# Altium project VCB25.PrjPCB (part 2 of 2)

## Sheet 9-Other_Inputs.SchDoc
size A4
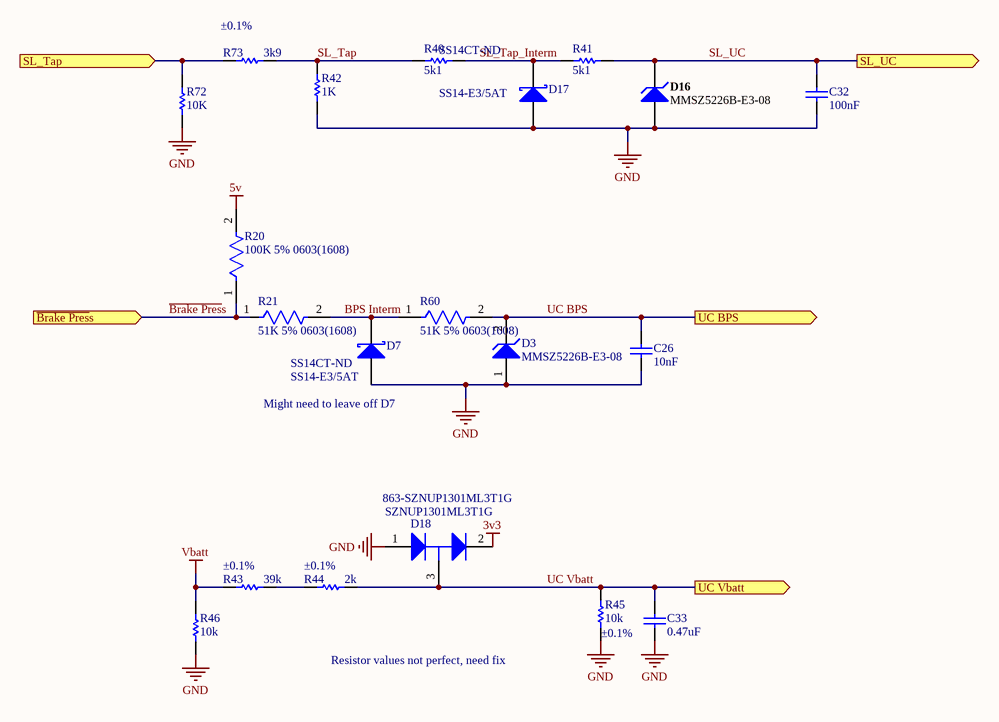
[diagram p4: 9-Other_Inputs.SchDoc]

### Parts
C26  value 10nF  [1608[0603]]  (hidden comment: Cap)
C32  value 100nF  [1608[0603]]  (hidden comment: Cap)
C33  value 0.47uF  [1608[0603]]  (hidden comment: Cap)
D3  MMSZ5226B-E3-08  [VISH-SOD-123-2_V]
D7  SS14-E3/5AT  Supplier Part Number 1: SS14CT-ND  [VISH-DO-214AC-2_V]
D16  MMSZ5226B-E3-08  [VISH-SOD-123-2_V]
D17  SS14-E3/5AT  Supplier Part Number 1: SS14CT-ND  [VISH-DO-214AC-2_V]
D18  SZNUP1301ML3T1G  Supplier Part Number 1: 863-SZNUP1301ML3T1G  [ONSC-SOT-23-3-318-08_V]
R20  100K 5% 0603(1608)  [RESC0603(1608)_N]
R21  51K 5% 0603(1608)  [RESC0603(1608)_N]
R40  value 5k1  [1608[0603]]  (hidden comment: Res1)
R41  value 5k1  [1608[0603]]  (hidden comment: Res1)
R42  value 1K  [1608[0603]]  (hidden comment: Res1)
R43  value 39k  Tolerance: ±0.1%  [1608[0603]]  (hidden comment: Res1)
R44  value 2k  Tolerance: ±0.1%  [1608[0603]]  (hidden comment: Res1)
R45  value 10k  Tolerance: ±0.1%  [1608[0603]]  (hidden comment: Res1)
R46  value 10k  [1608[0603]]  (hidden comment: Res1)
R60  51K 5% 0603(1608)  [RESC0603(1608)_N]
R72  10K  [RESC0603(1608)_N]
R73  value 3k9  Tolerance: ±0.1%  [1608[0603]]  (hidden comment: Res1)

### Ports
SL_Tap (in), SL_UC (out), UC BPS (out), UC Vbatt (out), ~{Brake Pres}s (in)

### Nets
3v3: D18.2(K)
5v: R20.2
GND: C26.1 C32.1 C33.1 D3.1(K) D7.1(A) D16.1(A) D17.1(A) D18.1(A) R42.1 R45.1 R46.1 R72.1
Vbatt: R43.1 R46.2
~{Brake Pres}s: R20.1 R21.1 ; port ~{Brake Pres}s
BPS Interm: D7.2(K) R21.2 R60.1
SL_Tap: R40.2 R42.2 R73.2
SL_Tap_Interm: D17.2(K) R40.1 R41.2
SL_UC: C32.2 D16.2(K) R41.1 ; port SL_UC
UC BPS: C26.2 D3.2(A) R60.2 ; port UC BPS
UC Vbatt: C33.2 D18.3(K/A) R44.2 R45.2 ; port UC Vbatt
NetR43_2: R43.2 R44.1
NetR72_2: R72.2 R73.1 ; port SL_Tap

### Notes on the sheet
- (near D7) Might need to leave off D7
- Resistor values not perfect, need fix

### Library data of the parts
C26 = Cap: Capacitor; Manufacturer: Yageo; Manufacturer Part Number: CC0603KRX7R9BB104; Capacitance: 0.10µF; Tolerance: ±10%; Voltage - Rated: 50V; Temperature Coefficient: X7R; Supplier 1: Digi-Key; Supplier Part Number 1: 311-1344-1-ND; RoHS: RoHS Compliant; Category: Capacitors; Stock 1: 4016262; Pricing 1: 1=0.15, 10=0.043, 25=0.0312, 50=0.0232, 100=0.0189, 250=0.0158, 500=0.01346, 1000=0.01059 (CAD); Packaging: Cut Tape (CT); Part Status: Active; Operating Temperature: -55°C ~ 125°C; Features: -; Ratings: -; Applications: General Purpose; Failure Rate: -; Mounting Type: Surface Mount, MLCC; Package / Case: 0603 (1608 Metric); Size / Dimension: 0.063" L x 0.031" W (1.60mm x 0.80mm); Height - Seated (Max): -; Thickness (Max): 0.035" (0.90mm); Lead Spacing: -; Lead Style: -; ComponentLink1URL: http://www.yageo.com/documents/recent/UPY-GPHC_X7R_6.3V-to-50V_16.pdf; ComponentLink1Description: http://www.yageo.com/documents/recent/UPY-GPHC_X7R_6.3V-to-50V_16.pdf
C32 = Cap: Capacitor; Manufacturer: Yageo; Manufacturer Part Number: CC0603KRX7R9BB102; Capacitance: 1000pF; Tolerance: ±10%; Voltage - Rated: 50V; Temperature Coefficient: X7R; Supplier 1: Digi-Key; Supplier Part Number 1: 311-1080-1-ND; RoHS: RoHS Compliant; Category: Capacitors; Stock 1: 783486; Pricing 1: 1=0.15, 10=0.029, 25=0.0212, 50=0.0158, 100=0.0129, 250=0.01084, 500=0.00928, 1000=0.00729 (CAD); Packaging: Cut Tape (CT); Part Status: Active; Operating Temperature: -55°C ~ 125°C; Features: -; Ratings: -; Applications: General Purpose; Failure Rate: -; Mounting Type: Surface Mount, MLCC; Package / Case: 0603 (1608 Metric); Size / Dimension: 0.063" L x 0.031" W (1.60mm x 0.80mm); Height - Seated (Max): -; Thickness (Max): 0.035" (0.90mm); Lead Spacing: -; Lead Style: -; ComponentLink1URL: http://www.yageo.com/documents/recent/UPY-GPHC_X7R_6.3V-to-50V_16.pdf; ComponentLink1Description: http://www.yageo.com/documents/recent/UPY-GPHC_X7R_6.3V-to-50V_16.pdf
C33 = Cap: Capacitor; Manufacturer: Yageo; Manufacturer Part Number: CC0603KRX7R8BB474; Capacitance: 0.47µF; Tolerance: ±10%; Voltage - Rated: 25V; Temperature Coefficient: X7R; Supplier 1: Digi-Key; Supplier Part Number 1: 311-1805-1-ND; RoHS: RoHS Compliant; Category: Capacitors; Stock 1: 11076; Pricing 1: 1=0.22, 10=0.158, 25=0.1156, 50=0.0898, 100=0.0745, 250=0.06168, 500=0.05226, 1000=0.04324 (CAD); Packaging: Cut Tape (CT); Part Status: Active; Operating Temperature: -55°C ~ 125°C; Features: -; Ratings: -; Applications: General Purpose; Failure Rate: -; Mounting Type: Surface Mount, MLCC; Package / Case: 0603 (1608 Metric); Size / Dimension: 0.063" L x 0.031" W (1.60mm x 0.80mm); Height - Seated (Max): -; Thickness (Max): 0.035" (0.90mm); Lead Spacing: -; Lead Style: -; ComponentLink1URL: http://www.yageo.com/documents/recent/UPY-GPHC_X7R_6.3V-to-50V_16.pdf; ComponentLink1Description: http://www.yageo.com/documents/recent/UPY-GPHC_X7R_6.3V-to-50V_16.pdf
D3 = CMP-1060-00513-1: Zener Voltage Regulator, 500 mW, 2-Pin SOD-123, Pb-Free, Tape and Reel; PartNumber: MMSZ3V6T1G; Manufacturer: On Semiconductor; P Max (W): 0.5; Packing: Tape and Reel; ComponentLink2URL: http://www.onsemi.com/pub_link/Collateral/MMSZ2V4T1-D.PDF; ComponentLink1Description: Manufacturer URL; PackageVersion: Rev. G, 10/2009; PackageDescription: 2-Pin SOD, Body 1.6 x 2.69 mm; ComponentLink2Description: Datasheet; DatasheetVersion: Rev. 11; ComponentLink3Description: Package Specification; ComponentLink3URL: http://www.onsemi.com/pub_link/Collateral/425-04.PDF; Mounting Technology: Surface Mount; PackageReference: SOD-123-2-425-04; ComponentLink1URL: http://www.onsemi.com/; RoHS: Pb-Free
D7 D17 = CMP-0549-00004-1: Schottky Barrier Rectifier, 40 V Maximum DC Blocking Voltage, -65 to 125 degC, 2-Pin SMA Case, RoHS; Manufacturer: Vishay Semiconductor; IFSM: 40 A; IF(AV): 1 A Max.; VRRM: 40 V Max.; VRMS: 28 V Max.; PackageReference: DO-214AC-2; RoHS: TRUE; DatasheetVersion: 12/17/2012; ComponentLink1Description: Manufacturer URL; ComponentLink2URL: http://www.vishay.com/docs/88746/ss12.pdf; PartNumber: SS14-E3/5AT; PackageVersion: Dec-12; Operating Temperature: -65 to 125 degC; ComponentLink3URL: http://www.vishay.com/docs/88746/ss12.pdf; PackageDescription: 2-Pin SMD, Body 4.245 x 2.665 mm, Height 2.29 mm; ComponentLink1URL: http://www.vishay.com/; ComponentLink3Description: Package Specification; ComponentLink2Description: Datasheet; Mounting Technology: Surface Mount; VDC: 40 V Max.; Supplier 1: Digi-Key
D16 = CMP-0931-00026-1: Small Signal Zener Diode, 3.3 V +/- 5%, -55 to 155 degC, 2-Pin SOD-123, RoHS, Tape and Reel; Manufacturer: Vishay Semiconductor; Manufacturer Part Number: MMSZ5226B-7-F; Tolerance: +/- 5%; Test Current (IZT1) (mA): 20; Power Dissipation (mW): 500; Int. Construction: Single; Zener Impedance (IZT1) (Max.) (Ohm): 28; Zener Voltage (NOM.) (V): 3.3; Voltage - Zener (Nom) (Vz): 3.3V; Power - Max: 500mW; Impedance (Max) (Zzt): 28 Ohm; Current - Reverse Leakage @ Vr: 25µA @ 1V; Voltage - Forward (Vf) (Max) @ If: 900mV @ 10mA; DatasheetVersion: Rev. 1.9; ComponentLink2Description: Datasheet; PackageReference: SOD-123-2; ComponentLink1URL: http://www.vishay.com/; ComponentLink1Description: Manufacturer URL; Mounting Technology: Surface Mount; ComponentLink3Description: Package Specification; ComponentLink3URL: http://www.vishay.com/docs/85774/mmsz5225.pdf; PartNumber: MMSZ5226B-E3-08; PackageDescription: 2-Pin SMD, Body 2.7 x 1.55 mm, Height 1.35 mm; Operating Temperature: -55 to 150 degC; Packing: Tape and Reel; PackageVersion: Rev. 1.9; ComponentLink2URL: http://www.vishay.com/docs/85774/mmsz5225.pdf; RoHS: TRUE; Supplier 1: Digi-Key; Supplier Part Number 1: MMSZ5226B-FDICT-ND; Category: Discrete Semiconductor Products; Stock 1: 45935; Pricing 1: 1=0.29, 10=0.263, 100=0.1426, 500=0.08778, 1000=0.05985 (CAD); Packaging: Cut Tape (CT); Part Status: Active; Mounting Type: Surface Mount; Package / Case: SOD-123; Supplier Device Package: SOD-123; ComponentLink4URL: http://www.diodes.com/_files/datasheets/ds18010.pdf; ComponentLink4Description: http://www.diodes.com/_files/datasheets/ds18010.pdf
D18 = CMP-1063-00171-1: Low Capacitance Diode Array for ESD Protection in a Single Data Line, 3-Pin SOT-23, Pb-Free, Tape and Reel; Manufacturer: On Semiconductor; C Max (pF): 0.9; Direction: Bidirectional; V(BR) Min (V): 70; Number of Lines: 1; Mounting Technology: Surface Mount; PackageReference: SOT-23-3-318-08; DatasheetVersion: Rev. 6; PackageVersion: Rev. AP, 11/2009; RoHS: Pb-Free; ComponentLink1Description: Manufacturer URL; ComponentLink1URL: http://www.onsemi.com/; PackageDescription: 3-Pin Small Outline Transistor, Body 2.92 x 1.3 mm, Pitch 0.95 mm; PartNumber: SZNUP1301ML3T1G; Packing: Tape and Reel; ComponentLink3URL: http://www.onsemi.cn/pub_link/Collateral/318-08.PDF; ComponentLink3Description: Package Specification; VRWM Max (V): 70; ComponentLink2Description: Datasheet; ComponentLink2URL: http://www.onsemi.cn/pub_link/Collateral/NUP1301ML3T1-D.PDF; Supplier 1: Mouser
R20 R21 R60 = CMP-26527-002098-1: 10kΩ ±5% 0.1W 0603 Thick Film Chip Resistor AEC-Q200 compliant; Power Rating: 100mW; Temperature Coefficient: 100ppm/°C; Resistance: 10kR; Radiation Hardening: No; Military Standard: Not; Mount: Surface Mount; Resistor Type: Thick Film; Size Code: 0603; Case/Package: 0603; Min Operating Temperature: -55°C; Construction: Rectangular; Series: RMCF; Width: 0.031inch; Length: 1.55mm; Case Code (Metric): 1608; Depth: 0.8mm; Height: 0.022inch; Packaging: Tape and Reel; Lead Free: Lead Free; Tolerance: 5%; Case Code (Imperial): 0603; Max Operating Temperature: 155°C; Contact Plating: Tin; Max Power Dissipation: 100mW; Features: Automotive AEC-Q200; Number of Terminations: 2
R40 R41 = Res1: Resistor; Manufacturer: Panasonic Electronic Components; Manufacturer Part Number: ERJ-PA3F1001V; Resistance (Ohms): 1k; Tolerance: ±1%; Power (Watts): 0.25W, 1/4W; Temperature Coefficient: ±100ppm/°C; Supplier 1: Digi-Key; Supplier Part Number 1: P1.0KBYCT-ND; RoHS: RoHS Compliant; Category: Resistors; Stock 1: 56110; Pricing 1: 1=0.22, 10=0.198, 25=0.138, 50=0.1072, 100=0.0765, 250=0.05972, 500=0.04746, 1000=0.03368 (CAD); Packaging: Cut Tape (CT); Part Status: Active; Composition: Thick Film; Features: Automotive AEC-Q200, Pulse Withstanding; Operating Temperature: -55°C ~ 155°C; Package / Case: 0603 (1608 Metric); Supplier Device Package: 0603; Size / Dimension: 0.063" L x 0.031" W (1.60mm x 0.80mm); Height - Seated (Max): 0.022" (0.55mm); Number of Terminations: 2; Failure Rate: -; ComponentLink1URL: https://industrial.panasonic.com/cdbs/www-data/pdf/RDA0000/AOA0000C243.pdf; ComponentLink1Description: https://industrial.panasonic.com/cdbs/www-data/pdf/RDA0000/AOA0000C243.pdf
R42 = Res1: Resistor; Manufacturer: Panasonic Electronic Components; Manufacturer Part Number: ERJ-PA3F1001V; Tolerance: ±1%; Power (Watts): 0.25W, 1/4W; Temperature Coefficient: ±100ppm/°C; Supplier 1: Digi-Key; Supplier Part Number 1: P1.0KBYCT-ND; RoHS: RoHS Compliant; Category: Resistors; Stock 1: 56110; Pricing 1: 1=0.22, 10=0.198, 25=0.138, 50=0.1072, 100=0.0765, 250=0.05972, 500=0.04746, 1000=0.03368 (CAD); Packaging: Cut Tape (CT); Part Status: Active; Resistance (Ohms): 1k; Composition: Thick Film; Features: Automotive AEC-Q200, Pulse Withstanding; Operating Temperature: -55°C ~ 155°C; Package / Case: 0603 (1608 Metric); Supplier Device Package: 0603; Size / Dimension: 0.063" L x 0.031" W (1.60mm x 0.80mm); Height - Seated (Max): 0.022" (0.55mm); Number of Terminations: 2; Failure Rate: -; ComponentLink1URL: https://industrial.panasonic.com/cdbs/www-data/pdf/RDA0000/AOA0000C243.pdf; ComponentLink1Description: https://industrial.panasonic.com/cdbs/www-data/pdf/RDA0000/AOA0000C243.pdf
R43 = Res1: Resistor; Manufacturer: Yageo; Manufacturer Part Number: RT0603BRD0739KL; Power (Watts): 0.1W, 1/10W; Temperature Coefficient: ±25ppm/°C; Supplier 1: Digi-Key; Supplier Part Number 1: YAG1649CT-ND; RoHS: RoHS Compliant; Category: Resistors; Stock 1: 2740; Pricing 1: 1=0.55, 10=0.464, 25=0.3376, 50=0.2446, 100=0.1814, 250=0.1392, 500=0.10966, 1000=0.07592 (CAD); Packaging: Cut Tape (CT); Part Status: Active; Resistance (Ohms): 39k; Composition: Thin Film; Features: Moisture Resistant; Operating Temperature: -55°C ~ 155°C; Package / Case: 0603 (1608 Metric); Supplier Device Package: 0603; Size / Dimension: 0.063" L x 0.031" W (1.60mm x 0.80mm); Height - Seated (Max): 0.022" (0.55mm); Number of Terminations: 2; Failure Rate: -; ComponentLink1URL: http://www.yageo.com/documents/recent/PYu-RT_1-to-0.05_RoHS_L_6.pdf; ComponentLink1Description: http://www.yageo.com/documents/recent/PYu-RT_1-to-0.05_RoHS_L_6.pdf
R44 = Res1: Resistor; Manufacturer: Yageo; Manufacturer Part Number: AT0603BRD072KL; Power (Watts): 0.1W, 1/10W; Temperature Coefficient: ±25ppm/°C; Supplier 1: Digi-Key; Supplier Part Number 1: YAG2112CT-ND; RoHS: RoHS Compliant; Category: Resistors; Stock 1: 1218; Pricing 1: 1=0.59, 10=0.431, 25=0.3188, 50=0.235, 100=0.1725, 250=0.14248, 500=0.11746, 1000=0.08498 (CAD); Packaging: Cut Tape (CT); Part Status: Active; Resistance (Ohms): 2k; Composition: Thin Film; Features: Anti-Sulfur, Automotive AEC-Q200, Moisture Resistant; Operating Temperature: -55°C ~ 155°C; Package / Case: 0603 (1608 Metric); Supplier Device Package: 0603; Size / Dimension: 0.063" L x 0.032" W (1.60mm x 0.80mm); Height - Seated (Max): 0.022" (0.55mm); Number of Terminations: 2; Failure Rate: -; ComponentLink1URL: http://www.yageo.com/documents/recent/PYu-AT_51_RoHS_L-3.pdf; ComponentLink1Description: http://www.yageo.com/documents/recent/PYu-AT_51_RoHS_L-3.pdf
R45 = Res1: Resistor; Manufacturer: Yageo; Manufacturer Part Number: RT0603BRD0710KL; Power (Watts): 0.1W, 1/10W; Temperature Coefficient: ±25ppm/°C; Supplier 1: Digi-Key; Supplier Part Number 1: YAG1236CT-ND; RoHS: RoHS Compliant; Category: Resistors; Stock 1: 2958; Pricing 1: 1=0.5, 10=0.42, 25=0.3048, 50=0.2212, 100=0.164, 250=0.12592, 500=0.0992, 1000=0.06867 (CAD); Packaging: Cut Tape (CT); Part Status: Active; Resistance (Ohms): 10k; Composition: Thin Film; Features: Moisture Resistant; Operating Temperature: -55°C ~ 155°C; Package / Case: 0603 (1608 Metric); Supplier Device Package: 0603; Size / Dimension: 0.063" L x 0.031" W (1.60mm x 0.80mm); Height - Seated (Max): 0.022" (0.55mm); Number of Terminations: 2; Failure Rate: -; ComponentLink1URL: http://www.yageo.com/documents/recent/PYu-RT_1-to-0.05_RoHS_L_6.pdf; ComponentLink1Description: http://www.yageo.com/documents/recent/PYu-RT_1-to-0.05_RoHS_L_6.pdf
R46 = Res1: Resistor; Manufacturer: Yageo; Manufacturer Part Number: RC0603JR-0710KL; Tolerance: ±5%; Power (Watts): 0.1W, 1/10W; Temperature Coefficient: ±100ppm/°C; Supplier 1: Digi-Key; Supplier Part Number 1: 311-10KGRCT-ND; RoHS: RoHS Compliant; Category: Resistors; Stock 1: 2936292; Pricing 1: 1=0.16, 10=0.016, 25=0.0112, 50=0.0084, 100=0.0062, 250=0.0048, 500=0.00382, 1000=0.00281 (CAD); Packaging: Cut Tape (CT); Part Status: Active; Resistance (Ohms): 10k; Composition: Thick Film; Features: Moisture Resistant; Operating Temperature: -55°C ~ 155°C; Package / Case: 0603 (1608 Metric); Supplier Device Package: 0603; Size / Dimension: 0.063" L x 0.031" W (1.60mm x 0.80mm); Height - Seated (Max): 0.022" (0.55mm); Number of Terminations: 2; Failure Rate: -; ComponentLink1URL: http://www.yageo.com/NewPortal/yageodocoutput?fileName=/pdf/R-Chip/PYu-RC_Group_51_RoHS_L_4.pdf; ComponentLink1Description: http://www.yageo.com/NewPortal/yageodocoutput?fileName=/pdf/R-Chip/PYu-RC_Group_51_RoHS_L_4.pdf
R72 = CMP-1012-00098-1: 10K 0.1W 5% 0603 (1608 Metric)  SMD; Case-EIA: 0603; Value: 10000.00 Ohm; Case-Metric: 1608; Technology: SMT; Tolerance: 5 %; Power: 0.1 W
R73 = Res1: Resistor; Manufacturer: Yageo; Manufacturer Part Number: RT0603BRD073K9L; Resistance (Ohms): 3.9k; Power (Watts): 0.1W, 1/10W; Temperature Coefficient: ±25ppm/°C; Supplier 1: Digi-Key; Supplier Part Number 1: YAG1656CT-ND; RoHS: RoHS Compliant; Category: Resistors; Stock 1: 10688; Pricing 1: 1=0.55, 10=0.464, 25=0.3376, 50=0.2446, 100=0.1814, 250=0.1392, 500=0.10966, 1000=0.07592 (CAD); Packaging: Cut Tape (CT); Part Status: Active; Composition: Thin Film; Features: Moisture Resistant; Operating Temperature: -55°C ~ 155°C; Package / Case: 0603 (1608 Metric); Supplier Device Package: 0603; Size / Dimension: 0.063" L x 0.031" W (1.60mm x 0.80mm); Height - Seated (Max): 0.022" (0.55mm); Number of Terminations: 2; Failure Rate: -; ComponentLink1URL: http://www.yageo.com/documents/recent/PYu-RT_1-to-0.05_RoHS_L_6.pdf; ComponentLink1Description: http://www.yageo.com/documents/recent/PYu-RT_1-to-0.05_RoHS_L_6.pdf

## Sheet 10-DashLEDs.SchDoc
size A4
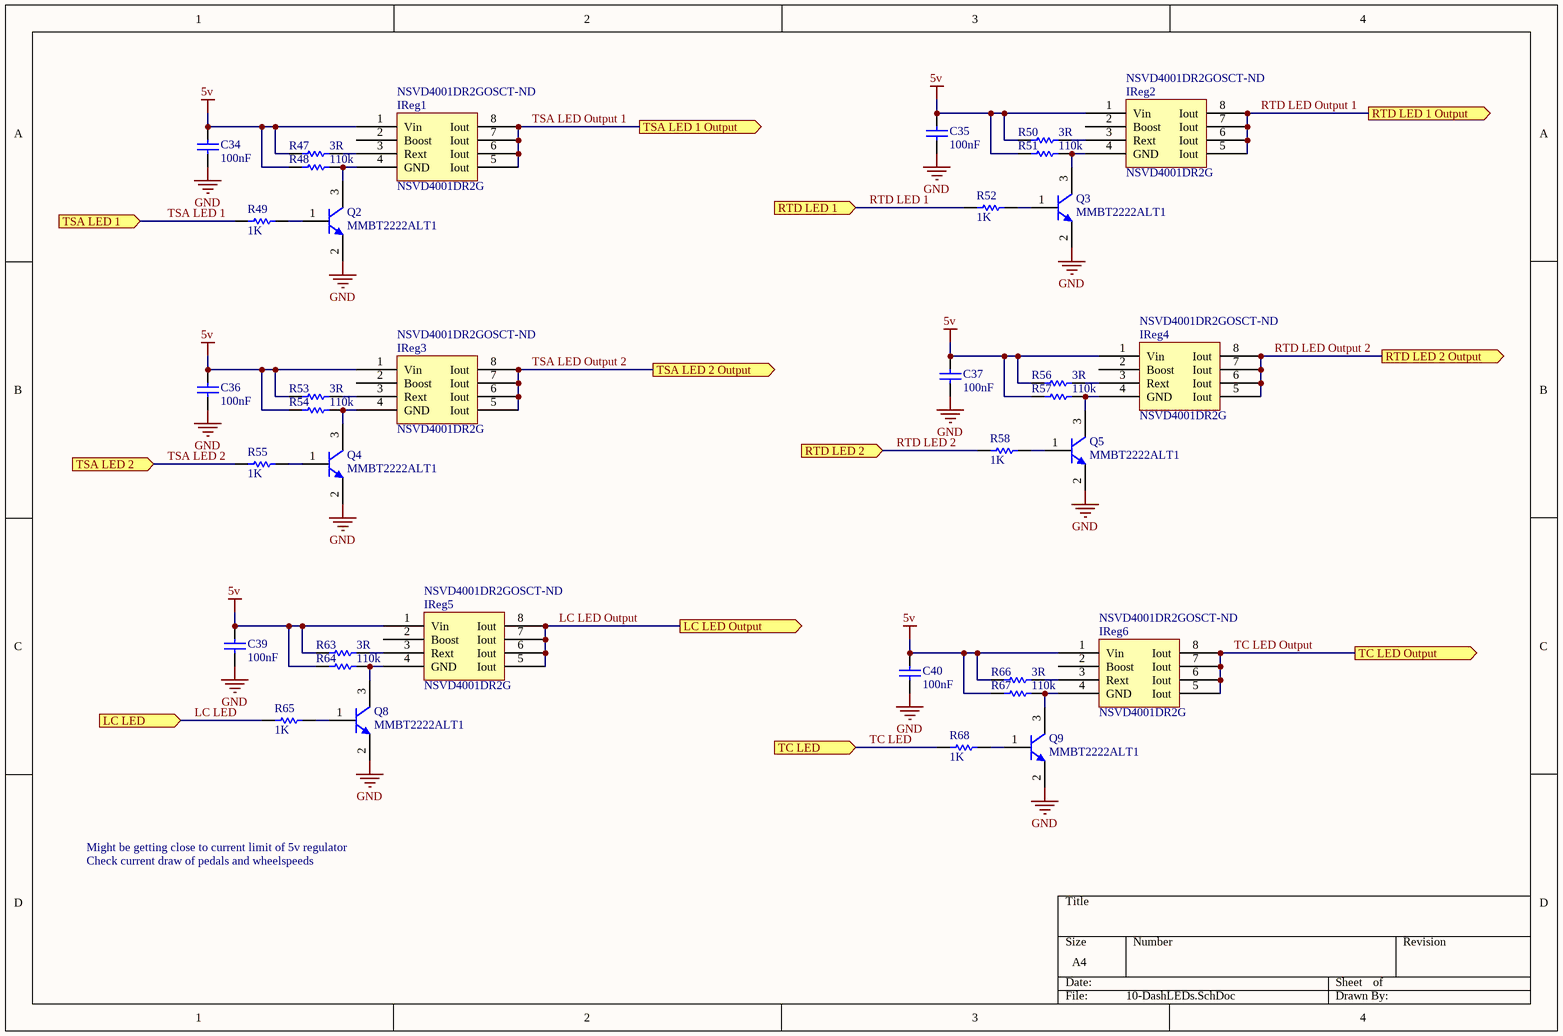
[diagram p5: 10-DashLEDs.SchDoc]

### Parts
C34  value 100nF  [1608[0603]]  (hidden comment: Cap)
C35  value 100nF  [1608[0603]]  (hidden comment: Cap)
C36  value 100nF  [1608[0603]]  (hidden comment: Cap)
C37  value 100nF  [1608[0603]]  (hidden comment: Cap)
C39  value 100nF  [1608[0603]]  (hidden comment: Cap)
C40  value 100nF  [1608[0603]]  (hidden comment: Cap)
IReg1  NSVD4001DR2G  Supplier Part Number 1: NSVD4001DR2GOSCT-ND  [SO8_M]
IReg2  NSVD4001DR2G  Supplier Part Number 1: NSVD4001DR2GOSCT-ND  [SO8_M]
IReg3  NSVD4001DR2G  Supplier Part Number 1: NSVD4001DR2GOSCT-ND  [SO8_M]
IReg4  NSVD4001DR2G  Supplier Part Number 1: NSVD4001DR2GOSCT-ND  [SO8_M]
IReg5  NSVD4001DR2G  Supplier Part Number 1: NSVD4001DR2GOSCT-ND  [SO8_M]
IReg6  NSVD4001DR2G  Supplier Part Number 1: NSVD4001DR2GOSCT-ND  [SO8_M]
Q2  MMBT2222ALT1  [ONSC-SOT-23-3-318-08_V]
Q3  MMBT2222ALT1  [ONSC-SOT-23-3-318-08_V]
Q4  MMBT2222ALT1  [ONSC-SOT-23-3-318-08_V]
Q5  MMBT2222ALT1  [ONSC-SOT-23-3-318-08_V]
Q8  MMBT2222ALT1  [ONSC-SOT-23-3-318-08_V]
Q9  MMBT2222ALT1  [ONSC-SOT-23-3-318-08_V]
R47  value 3R  [1608[0603]]  (hidden comment: Res1)
R48  value 110k  [1608[0603]]  (hidden comment: Res1)
R49  value 1K  [1608[0603]]  (hidden comment: Res1)
R50  value 3R  [1608[0603]]  (hidden comment: Res1)
R51  value 110k  [1608[0603]]  (hidden comment: Res1)
R52  value 1K  [1608[0603]]  (hidden comment: Res1)
R53  value 3R  [1608[0603]]  (hidden comment: Res1)
R54  value 110k  [1608[0603]]  (hidden comment: Res1)
R55  value 1K  [1608[0603]]  (hidden comment: Res1)
R56  value 3R  [1608[0603]]  (hidden comment: Res1)
R57  value 110k  [1608[0603]]  (hidden comment: Res1)
R58  value 1K  [1608[0603]]  (hidden comment: Res1)
R63  value 3R  [1608[0603]]  (hidden comment: Res1)
R64  value 110k  [1608[0603]]  (hidden comment: Res1)
R65  value 1K  [1608[0603]]  (hidden comment: Res1)
R66  value 3R  [1608[0603]]  (hidden comment: Res1)
R67  value 110k  [1608[0603]]  (hidden comment: Res1)
R68  value 1K  [1608[0603]]  (hidden comment: Res1)

### Ports
LC LED (in), LC LED Output (out), RTD LED 1 (in), RTD LED 1 Output (out), RTD LED 2 (in), RTD LED 2 Output (out), TC LED (in), TC LED Output (out), TSA LED 1 (in), TSA LED 1 Output (out), TSA LED 2 (in), TSA LED 2 Output (out)

### Nets
5v: C34.2 C35.2 C36.2 C37.2 C39.2 C40.2 IReg1.1(Vin) IReg2.1(Vin) IReg3.1(Vin) IReg4.1(Vin) IReg5.1(Vin) IReg6.1(Vin) R47.1 R48.1 R50.1 R51.1 R53.1 R54.1 R56.1 R57.1 R63.1 R64.1 R66.1 R67.1
GND: C34.1 C35.1 C36.1 C37.1 C39.1 C40.1 Q2.2(E) Q3.2(E) Q4.2(E) Q5.2(E) Q8.2(E) Q9.2(E)
LC LED: R65.2 ; port LC LED
LC LED Output: IReg5.5(Iout) IReg5.6(Iout) IReg5.7(Iout) IReg5.8(Iout) ; port LC LED Output
RTD LED 1: R52.2 ; port RTD LED 1
RTD LED 2: R58.2 ; port RTD LED 2
RTD LED Output 1: IReg2.5(Iout) IReg2.6(Iout) IReg2.7(Iout) IReg2.8(Iout) ; port RTD LED 1 Output  [project net RTD LED 1 Output]
RTD LED Output 2: IReg4.5(Iout) IReg4.6(Iout) IReg4.7(Iout) IReg4.8(Iout) ; port RTD LED 2 Output  [project net RTD LED 2 Output]
TC LED: R68.2 ; port TC LED
TC LED Output: IReg6.5(Iout) IReg6.6(Iout) IReg6.7(Iout) IReg6.8(Iout) ; port TC LED Output
TSA LED 1: R49.2 ; port TSA LED 1
TSA LED 2: R55.2 ; port TSA LED 2
TSA LED Output 1: IReg1.5(Iout) IReg1.6(Iout) IReg1.7(Iout) IReg1.8(Iout) ; port TSA LED 1 Output  [project net TSA LED 1 Output]
TSA LED Output 2: IReg3.5(Iout) IReg3.6(Iout) IReg3.7(Iout) IReg3.8(Iout) ; port TSA LED 2 Output  [project net TSA LED 2 Output]
NetIReg1_3: IReg1.3(Rext) R47.2
NetIReg1_4: IReg1.4(GND) Q2.3(C) R48.2
NetIReg2_3: IReg2.3(Rext) R50.2
NetIReg2_4: IReg2.4(GND) Q3.3(C) R51.2
NetIReg3_3: IReg3.3(Rext) R53.2
NetIReg3_4: IReg3.4(GND) Q4.3(C) R54.2
NetIReg4_3: IReg4.3(Rext) R56.2
NetIReg4_4: IReg4.4(GND) Q5.3(C) R57.2
NetIReg5_3: IReg5.3(Rext) R63.2
NetIReg5_4: IReg5.4(GND) Q8.3(C) R64.2
NetIReg6_3: IReg6.3(Rext) R66.2
NetIReg6_4: IReg6.4(GND) Q9.3(C) R67.2
NetQ2_1: Q2.1(B) R49.1
NetQ3_1: Q3.1(B) R52.1
NetQ4_1: Q4.1(B) R55.1
NetQ5_1: Q5.1(B) R58.1
NetQ8_1: Q8.1(B) R65.1
NetQ9_1: Q9.1(B) R68.1

Not connected (* = marked no-connect by the designer): IReg1 2(Boost); IReg2 2(Boost); IReg3 2(Boost); IReg4 2(Boost); IReg5 2(Boost); IReg6 2(Boost)

### Notes on the sheet
- Might be getting close to current limit of 5v regulator
- Check current draw of pedals and wheelspeeds

### Library data of the parts
C34-C37 C39 C40 = Cap: as C26 on sheet 9-Other_Inputs; Supplier 1: Digi-Key; Supplier Part Number 1: 311-1344-1-ND; RoHS: RoHS Compliant; Category: Capacitors; Stock 1: 4016262; Pricing 1: 1=0.15, 10=0.043, 25=0.0312, 50=0.0232, 100=0.0189, 250=0.0158, 500=0.01346, 1000=0.01059 (CAD); Packaging: Cut Tape (CT); Part Status: Active; Operating Temperature: -55°C ~ 125°C; Features: -; Ratings: -; Applications: General Purpose; Failure Rate: -; Mounting Type: Surface Mount, MLCC; Package / Case: 0603 (1608 Metric); Size / Dimension: 0.063" L x 0.031" W (1.60mm x 0.80mm); Height - Seated (Max): -; Thickness (Max): 0.035" (0.90mm); Lead Spacing: -; Lead Style: -; ComponentLink1URL: http://www.yageo.com/documents/recent/UPY-GPHC_X7R_6.3V-to-50V_16.pdf; ComponentLink1Description: http://www.yageo.com/documents/recent/UPY-GPHC_X7R_6.3V-to-50V_16.pdf
IReg1-IReg6 = LED Currnet Driver, 500mA, 30V max: Manufacturer: ON Semiconductor; Manufacturer Part Number: NUD4001DR2G; Internal Switch(s): Yes; Number of Outputs: 1; Voltage - Supply (Min): 3.6V; Voltage - Supply (Max): 30V; Voltage - Output: 28V; Current - Output / Channel: 500mA; Dimming: PWM; RoHS: RoHS Compliant; Category: Integrated Circuits (ICs); Stock 1: 212669; Pricing 1: 1=1.36, 10=1.197, 100=0.9174, 500=0.72524, 1000=0.58019 (CAD); Packaging: Cut Tape (CT); Part Status: Active; Type: Linear; Topology: -; Frequency: -; Applications: Automotive, Lighting; Operating Temperature: -40°C ~ 125°C (TA); Mounting Type: Surface Mount; Package / Case: 8-SOIC (0.154", 3.90mm Width); Supplier Device Package: 8-SOIC; ComponentLink1URL: http://www.onsemi.com/pub_link/Collateral/NUD4001-D.PDF; ComponentLink1Description: http://www.onsemi.com/pub_link/Collateral/NUD4001-D.PDF; Supplier 1: Digi-Key
Q2-Q5 Q8 Q9 = CMP-1048-00593-1: General Purpose Transistor, NPN Silicon, 3-Pin SOT-23, Tape and Reel; Manufacturer: On Semiconductor; fT Min (MHz): 300; IC Continuous (A): 0.6; ComponentLink1Description: Manufacturer URL; PackageDescription: 3-Pin Small Outline Transistor, Body 2.92 x 1.3 mm, Pitch 0.95 mm; PackageReference: SOT-23-3-318-08; Polarity: NPN; Packing: Tape and Reel; RoHS: FALSE; Mounting Technology: Surface Mount; PackageVersion: Rev. AP, 11/2009; DatasheetVersion: Rev. 10; PartNumber: MMBT2222ALT1; ComponentLink3Description: Package Specification; ComponentLink2Description: Datasheet; ComponentLink3URL: http://www.onsemi.cn/pub_link/Collateral/318-08.PDF; ComponentLink1URL: http://www.onsemi.com/; ComponentLink2URL: http://www.onsemi.cn/pub_link/Collateral/MMBT2222LT1-D.PDF
R47 R50 R53 R56 R63 R66 = Res1: Resistor; Manufacturer: Yageo; Manufacturer Part Number: RC0603FR-072RL; Resistance (Ohms): 2; Tolerance: ±1%; Power (Watts): 0.1W, 1/10W; Temperature Coefficient: ±200ppm/°C; Supplier 1: Digi-Key; Supplier Part Number 1: 311-2.00HRCT-ND; RoHS: RoHS Compliant; Category: Resistors; Stock 1: 84378; Pricing 1: 1=0.16, 10=0.03, 25=0.022, 50=0.0166, 100=0.0122, 250=0.00936, 500=0.00746, 1000=0.0055 (CAD); Packaging: Cut Tape (CT); Part Status: Active; Composition: Thick Film; Features: Moisture Resistant; Operating Temperature: -55°C ~ 155°C; Package / Case: 0603 (1608 Metric); Supplier Device Package: 0603; Size / Dimension: 0.063" L x 0.031" W (1.60mm x 0.80mm); Height - Seated (Max): 0.022" (0.55mm); Number of Terminations: 2; Failure Rate: -; ComponentLink1URL: http://www.yageo.com/NewPortal/yageodocoutput?fileName=/pdf/R-Chip/PYu-RC_Group_51_RoHS_L_4.pdf; ComponentLink1Description: http://www.yageo.com/NewPortal/yageodocoutput?fileName=/pdf/R-Chip/PYu-RC_Group_51_RoHS_L_4.pdf
R48 R51 R54 R57 R64 R67 = Res1: Resistor; Manufacturer: Yageo; Manufacturer Part Number: RC0603JR-07110KL; Tolerance: ±5%; Power (Watts): 0.1W, 1/10W; Temperature Coefficient: ±100ppm/°C; Supplier 1: Digi-Key; Supplier Part Number 1: 311-110KGRCT-ND; RoHS: RoHS Compliant; Category: Resistors; Stock 1: 85509; Pricing 1: 1=0.16, 10=0.016, 25=0.0112, 50=0.0084, 100=0.0062, 250=0.0048, 500=0.00382, 1000=0.00281 (CAD); Packaging: Cut Tape (CT); Part Status: Active; Resistance (Ohms): 110k; Composition: Thick Film; Features: Moisture Resistant; Operating Temperature: -55°C ~ 155°C; Package / Case: 0603 (1608 Metric); Supplier Device Package: 0603; Size / Dimension: 0.063" L x 0.031" W (1.60mm x 0.80mm); Height - Seated (Max): 0.022" (0.55mm); Number of Terminations: 2; Failure Rate: -; ComponentLink1URL: http://www.yageo.com/NewPortal/yageodocoutput?fileName=/pdf/R-Chip/PYu-RC_Group_51_RoHS_L_4.pdf; ComponentLink1Description: http://www.yageo.com/NewPortal/yageodocoutput?fileName=/pdf/R-Chip/PYu-RC_Group_51_RoHS_L_4.pdf
R49 R52 R55 R58 R65 R68 = Res1: as R42 on sheet 9-Other_Inputs; Supplier 1: Digi-Key; Supplier Part Number 1: P1.0KBYCT-ND; RoHS: RoHS Compliant; Category: Resistors; Stock 1: 56110; Pricing 1: 1=0.22, 10=0.198, 25=0.138, 50=0.1072, 100=0.0765, 250=0.05972, 500=0.04746, 1000=0.03368 (CAD); Packaging: Cut Tape (CT); Part Status: Active; Resistance (Ohms): 1k; Composition: Thick Film; Features: Automotive AEC-Q200, Pulse Withstanding; Operating Temperature: -55°C ~ 155°C; Package / Case: 0603 (1608 Metric); Supplier Device Package: 0603; Size / Dimension: 0.063" L x 0.031" W (1.60mm x 0.80mm); Height - Seated (Max): 0.022" (0.55mm); Number of Terminations: 2; Failure Rate: -; ComponentLink1URL: https://industrial.panasonic.com/cdbs/www-data/pdf/RDA0000/AOA0000C243.pdf; ComponentLink1Description: https://industrial.panasonic.com/cdbs/www-data/pdf/RDA0000/AOA0000C243.pdf

## Sheet 12-Dash_Inputs.SchDoc
size A4
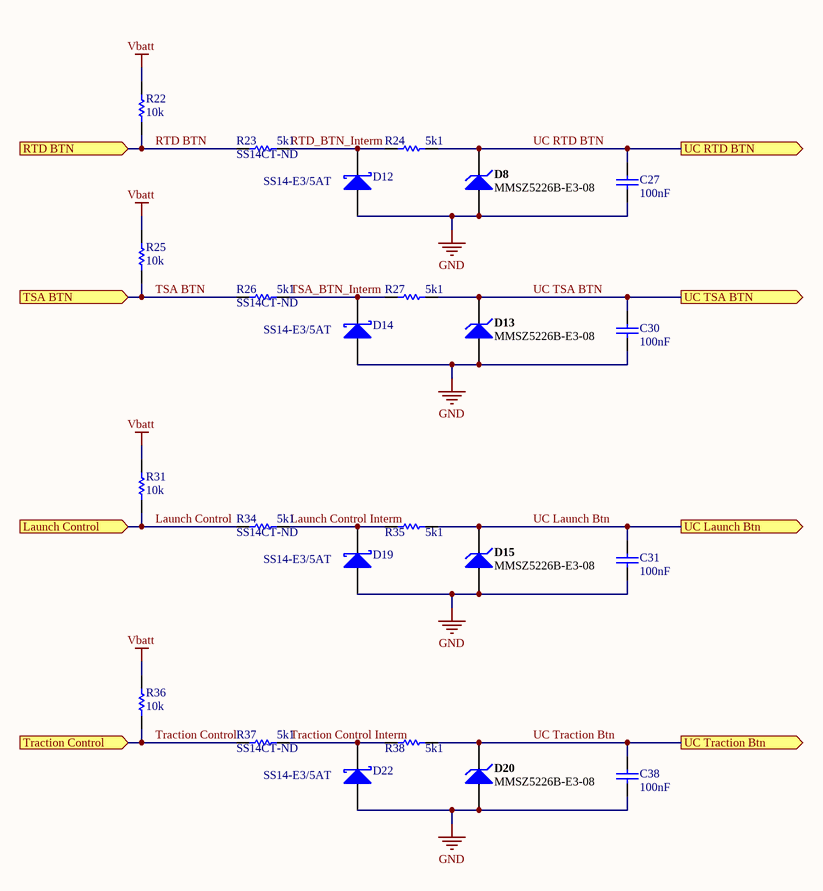
[diagram p6: 12-Dash_Inputs.SchDoc]

### Parts
C27  value 100nF  [1608[0603]]  (hidden comment: Cap)
C30  value 100nF  [1608[0603]]  (hidden comment: Cap)
C31  value 100nF  [1608[0603]]  (hidden comment: Cap)
C38  value 100nF  [1608[0603]]  (hidden comment: Cap)
D8  MMSZ5226B-E3-08  [VISH-SOD-123-2_V]
D12  SS14-E3/5AT  Supplier Part Number 1: SS14CT-ND  [VISH-DO-214AC-2_V]
D13  MMSZ5226B-E3-08  [VISH-SOD-123-2_V]
D14  SS14-E3/5AT  Supplier Part Number 1: SS14CT-ND  [VISH-DO-214AC-2_V]
D15  MMSZ5226B-E3-08  [VISH-SOD-123-2_V]
D19  SS14-E3/5AT  Supplier Part Number 1: SS14CT-ND  [VISH-DO-214AC-2_V]
D20  MMSZ5226B-E3-08  [VISH-SOD-123-2_V]
D22  SS14-E3/5AT  Supplier Part Number 1: SS14CT-ND  [VISH-DO-214AC-2_V]
R22  value 10k  [1608[0603]]  (hidden comment: Res1)
R23  value 5k1  [1608[0603]]  (hidden comment: Res1)
R24  value 5k1  [1608[0603]]  (hidden comment: Res1)
R25  value 10k  [1608[0603]]  (hidden comment: Res1)
R26  value 5k1  [1608[0603]]  (hidden comment: Res1)
R27  value 5k1  [1608[0603]]  (hidden comment: Res1)
R31  value 10k  [1608[0603]]  (hidden comment: Res1)
R34  value 5k1  [1608[0603]]  (hidden comment: Res1)
R35  value 5k1  [1608[0603]]  (hidden comment: Res1)
R36  value 10k  [1608[0603]]  (hidden comment: Res1)
R37  value 5k1  [1608[0603]]  (hidden comment: Res1)
R38  value 5k1  [1608[0603]]  (hidden comment: Res1)

### Ports
Launch Control (in), RTD BTN (in), Traction Control (in), TSA BTN (in), UC Launch Btn (out), UC RTD BTN (out), UC Traction Btn (out), UC TSA BTN (out)

### Nets
GND: C27.1 C30.1 C31.1 C38.1 D8.1(A) D12.1(A) D13.1(A) D14.1(A) D15.1(A) D19.1(A) D20.1(A) D22.1(A)
Vbatt: R22.2 R25.2 R31.2 R36.2
Launch Control: R31.1 R34.1 ; port Launch Control
Launch Control Interm: D19.2(K) R34.2 R35.1
RTD BTN: R22.1 R23.1 ; port RTD BTN
RTD_BTN_Interm: D12.2(K) R23.2 R24.1
Traction Control: R36.1 R37.1 ; port Traction Control
Traction Control Interm: D22.2(K) R37.2 R38.1
TSA BTN: R25.1 R26.1 ; port TSA BTN
TSA_BTN_Interm: D14.2(K) R26.2 R27.1
UC Launch Btn: C31.2 D15.2(K) R35.2 ; port UC Launch Btn
UC RTD BTN: C27.2 D8.2(K) R24.2 ; port UC RTD BTN
UC Traction Btn: C38.2 D20.2(K) R38.2 ; port UC Traction Btn
UC TSA BTN: C30.2 D13.2(K) R27.2 ; port UC TSA BTN

### Library data of the parts
C27 C30 C31 C38 = Cap: as C26 on sheet 9-Other_Inputs; Supplier 1: Digi-Key; Supplier Part Number 1: 311-1344-1-ND; RoHS: RoHS Compliant; Category: Capacitors; Stock 1: 4016262; Pricing 1: 1=0.15, 10=0.043, 25=0.0312, 50=0.0232, 100=0.0189, 250=0.0158, 500=0.01346, 1000=0.01059 (CAD); Packaging: Cut Tape (CT); Part Status: Active; Operating Temperature: -55°C ~ 125°C; Features: -; Ratings: -; Applications: General Purpose; Failure Rate: -; Mounting Type: Surface Mount, MLCC; Package / Case: 0603 (1608 Metric); Size / Dimension: 0.063" L x 0.031" W (1.60mm x 0.80mm); Height - Seated (Max): -; Thickness (Max): 0.035" (0.90mm); Lead Spacing: -; Lead Style: -; ComponentLink1URL: http://www.yageo.com/documents/recent/UPY-GPHC_X7R_6.3V-to-50V_16.pdf; ComponentLink1Description: http://www.yageo.com/documents/recent/UPY-GPHC_X7R_6.3V-to-50V_16.pdf
D8 D13 D15 D20 = CMP-0931-00026-1: as D16 on sheet 9-Other_Inputs; DatasheetVersion: Rev. 1.9; ComponentLink2Description: Datasheet; PackageReference: SOD-123-2; ComponentLink1URL: http://www.vishay.com/; ComponentLink1Description: Manufacturer URL; Mounting Technology: Surface Mount; ComponentLink3Description: Package Specification; ComponentLink3URL: http://www.vishay.com/docs/85774/mmsz5225.pdf; PartNumber: MMSZ5226B-E3-08; PackageDescription: 2-Pin SMD, Body 2.7 x 1.55 mm, Height 1.35 mm; Operating Temperature: -55 to 150 degC; Packing: Tape and Reel; PackageVersion: Rev. 1.9; ComponentLink2URL: http://www.vishay.com/docs/85774/mmsz5225.pdf; RoHS: TRUE; Supplier 1: Digi-Key; Supplier Part Number 1: MMSZ5226B-FDICT-ND; Category: Discrete Semiconductor Products; Stock 1: 45935; Pricing 1: 1=0.29, 10=0.263, 100=0.1426, 500=0.08778, 1000=0.05985 (CAD); Packaging: Cut Tape (CT); Part Status: Active; Mounting Type: Surface Mount; Package / Case: SOD-123; Supplier Device Package: SOD-123; ComponentLink4URL: http://www.diodes.com/_files/datasheets/ds18010.pdf; ComponentLink4Description: http://www.diodes.com/_files/datasheets/ds18010.pdf
D12 D14 D19 D22 = CMP-0549-00004-1: as D7 on sheet 9-Other_Inputs; PackageReference: DO-214AC-2; RoHS: TRUE; DatasheetVersion: 12/17/2012; ComponentLink1Description: Manufacturer URL; ComponentLink2URL: http://www.vishay.com/docs/88746/ss12.pdf; PartNumber: SS14-E3/5AT; PackageVersion: Dec-12; Operating Temperature: -65 to 125 degC; ComponentLink3URL: http://www.vishay.com/docs/88746/ss12.pdf; PackageDescription: 2-Pin SMD, Body 4.245 x 2.665 mm, Height 2.29 mm; ComponentLink1URL: http://www.vishay.com/; ComponentLink3Description: Package Specification; ComponentLink2Description: Datasheet; Mounting Technology: Surface Mount; VDC: 40 V Max.; Supplier 1: Digi-Key
R22 R25 R31 R36 = Res1: as R46 on sheet 9-Other_Inputs; Supplier 1: Digi-Key; Supplier Part Number 1: 311-10KGRCT-ND; RoHS: RoHS Compliant; Category: Resistors; Stock 1: 2936292; Pricing 1: 1=0.16, 10=0.016, 25=0.0112, 50=0.0084, 100=0.0062, 250=0.0048, 500=0.00382, 1000=0.00281 (CAD); Packaging: Cut Tape (CT); Part Status: Active; Resistance (Ohms): 10k; Composition: Thick Film; Features: Moisture Resistant; Operating Temperature: -55°C ~ 155°C; Package / Case: 0603 (1608 Metric); Supplier Device Package: 0603; Size / Dimension: 0.063" L x 0.031" W (1.60mm x 0.80mm); Height - Seated (Max): 0.022" (0.55mm); Number of Terminations: 2; Failure Rate: -; ComponentLink1URL: http://www.yageo.com/NewPortal/yageodocoutput?fileName=/pdf/R-Chip/PYu-RC_Group_51_RoHS_L_4.pdf; ComponentLink1Description: http://www.yageo.com/NewPortal/yageodocoutput?fileName=/pdf/R-Chip/PYu-RC_Group_51_RoHS_L_4.pdf
R23 R24 R26 R27 R34 R35 R37 R38 = Res1: Resistor; Manufacturer: Yageo; Manufacturer Part Number: RC0603JR-075K1L; Resistance (Ohms): 5.1k; Tolerance: ±5%; Power (Watts): 0.1W, 1/10W; Temperature Coefficient: ±100ppm/°C; Supplier 1: Digi-Key; Supplier Part Number 1: 311-5.1KGRCT-ND; RoHS: RoHS Compliant; Category: Resistors; Stock 1: 782184; Pricing 1: 1=0.16, 10=0.016, 25=0.0112, 50=0.0084, 100=0.0062, 250=0.0048, 500=0.00382, 1000=0.00281 (CAD); Packaging: Cut Tape (CT); Part Status: Active; Composition: Thick Film; Features: Moisture Resistant; Operating Temperature: -55°C ~ 155°C; Package / Case: 0603 (1608 Metric); Supplier Device Package: 0603; Size / Dimension: 0.063" L x 0.031" W (1.60mm x 0.80mm); Height - Seated (Max): 0.022" (0.55mm); Number of Terminations: 2; Failure Rate: -; ComponentLink1URL: http://www.yageo.com/NewPortal/yageodocoutput?fileName=/pdf/R-Chip/PYu-RC_Group_51_RoHS_L_4.pdf; ComponentLink1Description: http://www.yageo.com/NewPortal/yageodocoutput?fileName=/pdf/R-Chip/PYu-RC_Group_51_RoHS_L_4.pdf

## Sheet 13-Fusing.SchDoc
size A4
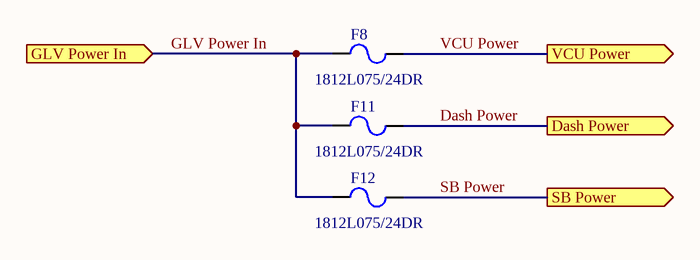
[diagram p7: 13-Fusing.SchDoc]

### Parts
F8  1812L075/24DR  [LFUS-1812L07524DR_V]
F11  1812L075/24DR  [LFUS-1812L07524DR_V]
F12  1812L075/24DR  [LFUS-1812L07524DR_V]

### Ports
Dash Power (out), GLV Power In (in), SB Power (out), VCU Power (out)

### Nets
VCU Power: F8.2 ; port VCU Power
Dash Power: F11.2 ; port Dash Power
GLV Power In: F8.1 F11.1 F12.1 ; port GLV Power In
SB Power: F12.2 ; port SB Power

### Library data of the parts
F8 F11 F12 = CMP-2000-05510-1: Poly-Fuse(R) Resettable PTC, 24 V, 100 A, -40 to 85 degC, 2-Pin SMD, RoHS, Tape and Reel; Manufacturer: Littelfuse; Resistance: 290mOhms; Current Rating - Max: 100A; Maximum Voltage: 24VDC; Hold Current: 0.75A; Trip Current: 1.5A; Maximum Voltage DC: 24V; Type: PolyFuseResettablePTC; Datasheet Version: 02/2016; Package / Case: 1812(4532metric); Mounting Technology: SurfaceMount; Packaging: Reel; Package Description: 2-Pin Surface Mount Device, Body 4.55 x 3.24 mm; Brand: Littelfuse; Manufacturer URL: http://www.littelfuse.com/; Mounting Style: SMD/SMT; Dimensions: 4.37mmLx3.07mmWx0.75mmH; Operating Temperature Range: -40Cto+85C; Product Category: ResettableFuses-PPTC; Current Rating: 100A; Termination Style: SMD/SMT; Factory Pack Quantity: 1500; Current Rating (Max): 100A; Package Reference: 1812L07524DR; RoHS: Details; Series: 1812L; Datasheet URL: http://www.littelfuse.com/~/media/electronics/datasheets/resettable_ptcs/littelfuse_ptc_1812l_datasheet.pdf.pdf

## Nets that join several sheets
3v3: 1-Controller (15 pins), 2-Power (C18.2 R7.1 R8.2 REG2.3), 5-Connector (D9.2 D10.2 D11.2 D23.2), 8-Bluetooth (BT2.4 C28.2), 9-Other_Inputs (D18.2)
3v3Ref: 1-Controller (C3.2 U1.21), 2-Power (C11.2 Ref1.6)
5v: 2-Power (5 pins), 5-Connector (F1.1 F2.1), 9-Other_Inputs (R20.2), 10-DashLEDs (24 pins)
GND: 1-Controller (23 pins), 2-Power (18 pins), 5-Connector (11 pins), 8-Bluetooth (9 pins), 9-Other_Inputs (12 pins), 10-DashLEDs (12 pins), 12-Dash_Inputs (12 pins)
Vbatt: 2-Power (10 pins), 9-Other_Inputs (R43.1 R46.2), 12-Dash_Inputs (R22.2 R25.2 R31.2 R36.2)
VCU Power: 2-Power (Q1.3), 13-Fusing (F8.2)
~{Brake Pres}s: 5-Connector (CN1.10), 9-Other_Inputs (R20.1 R21.1)
BT EAN: 1-Controller (U1.88), 8-Bluetooth (BT2.20)
BT NCTS: 1-Controller (U1.58), 8-Bluetooth (BT2.15)
BT NRTS: 1-Controller (U1.59), 8-Bluetooth (BT2.17)
BT P2_0: 1-Controller (U1.62), 8-Bluetooth (BT2.18)
BT P2_4: 1-Controller (U1.61), 8-Bluetooth (BT2.19)
BT Reset: 1-Controller (U1.57), 8-Bluetooth (BT2.21)
Dash Power: 5-Connector (CN1.27), 13-Fusing (F11.2)
GLV Power In: 5-Connector (CN1.22), 13-Fusing (F8.1 F11.1 F12.1)
LC LED: 1-Controller (U1.23), 10-DashLEDs (R65.2)
NRST: 1-Controller (C1.2 U1.14), 5-Connector (D9.3 F5.1)
P0_4: 1-Controller (U1.78), 8-Bluetooth (DS4.1 R70.1)
P1_5: 1-Controller (U1.79), 8-Bluetooth (DS5.1 R71.1)
RTD BTN: 5-Connector (CN1.8), 12-Dash_Inputs (R22.1 R23.1)
RTD LED 1: 1-Controller (U1.3), 10-DashLEDs (R52.2)
RTD LED 1 Output: 5-Connector (CN1.14), 10-DashLEDs (IReg2.5 IReg2.6 IReg2.7 IReg2.8)
RTD LED 2: 1-Controller (U1.1), 10-DashLEDs (R58.2)
RTD LED 2 Output: 5-Connector (CN1.17), 10-DashLEDs (IReg4.5 IReg4.6 IReg4.7 IReg4.8)
SL_Control: 1-Controller (U1.43), 2-Power (R61.2 R62.2)
SL_UC: 1-Controller (U1.87), 9-Other_Inputs (C32.2 D16.2 R41.1)
SWDIO: 1-Controller (U1.72), 5-Connector (D23.3 F3.1)
TC LED: 1-Controller (U1.24), 10-DashLEDs (R68.2)
TSA BTN: 5-Connector (CN1.7), 12-Dash_Inputs (R25.1 R26.1)
TSA LED 1: 1-Controller (U1.4), 10-DashLEDs (R49.2)
TSA LED 1 Output: 5-Connector (CN1.13), 10-DashLEDs (IReg1.5 IReg1.6 IReg1.7 IReg1.8)
TSA LED 2: 1-Controller (U1.2), 10-DashLEDs (R55.2)
TSA LED 2 Output: 5-Connector (CN1.16), 10-DashLEDs (IReg3.5 IReg3.6 IReg3.7 IReg3.8)
UC BPS: 1-Controller (U1.17), 9-Other_Inputs (C26.2 D3.2 R60.2)
UC BT Rx: 1-Controller (U1.56), 8-Bluetooth (R32.2)
UC BT Tx: 1-Controller (U1.55), 8-Bluetooth (R33.2)
UC Launch Btn: 1-Controller (U1.37), 12-Dash_Inputs (C31.2 D15.2 R35.2)
UC RTD BTN: 1-Controller (U1.36), 12-Dash_Inputs (C27.2 D8.2 R24.2)
UC SW BTN: 1-Controller (U1.60), 8-Bluetooth (BT2.5)
UC SWCLK: 1-Controller (U1.76), 5-Connector (D11.3 F7.1)
UC SWO: 1-Controller (U1.89), 5-Connector (D10.3 F6.1)
UC Traction Btn: 1-Controller (U1.34), 12-Dash_Inputs (C38.2 D20.2 R38.2)
UC TSA BTN: 1-Controller (U1.35), 12-Dash_Inputs (C30.2 D13.2 R27.2)
UC Vbatt: 1-Controller (U1.32), 9-Other_Inputs (C33.2 D18.3 R44.2 R45.2)